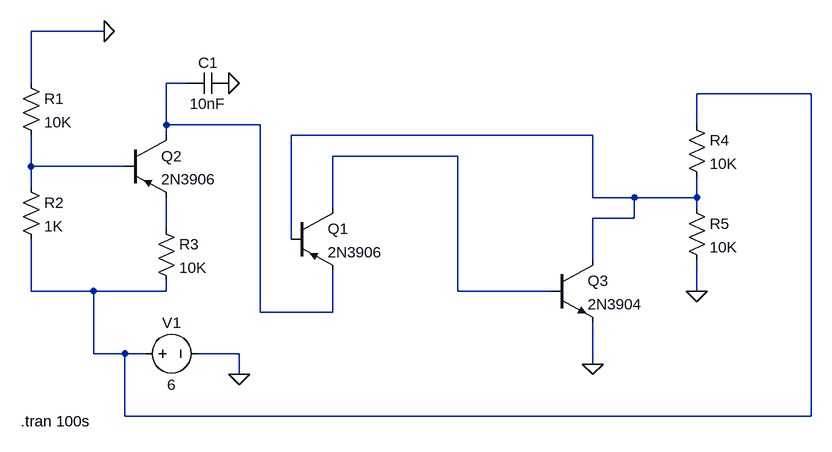
[diagram p0: schematic positive ramp.asc]
positive ramp.asc, the LTspice schematic file:
Version 4
SHEET 1 1044 680
WIRE -48 -112 -160 -112
WIRE -160 -32 -160 -112
WIRE 80 -32 48 -32
WIRE 1040 -16 864 -16
WIRE 48 32 48 -32
WIRE 192 32 48 32
WIRE 864 32 864 -16
WIRE 48 48 48 32
WIRE 704 48 240 48
WIRE 496 80 304 80
WIRE -160 96 -160 48
WIRE -16 96 -160 96
WIRE -160 128 -160 96
WIRE 704 144 704 48
WIRE 768 144 704 144
WIRE 864 144 864 112
WIRE 864 144 768 144
WIRE 304 160 304 80
WIRE 864 160 864 144
WIRE 768 176 768 144
WIRE 768 176 704 176
WIRE 48 192 48 144
WIRE 240 208 240 48
WIRE 704 240 704 176
WIRE -160 288 -160 208
WIRE -64 288 -160 288
WIRE 48 288 48 272
WIRE 48 288 -64 288
WIRE 496 288 496 80
WIRE 640 288 496 288
WIRE 864 288 864 240
WIRE 192 320 192 32
WIRE 304 320 304 256
WIRE 304 320 192 320
WIRE -64 384 -64 288
WIRE -16 384 -64 384
WIRE 16 384 -16 384
WIRE 160 384 96 384
WIRE 704 400 704 336
WIRE 160 416 160 384
WIRE -16 480 -16 384
WIRE 1040 480 1040 -16
WIRE 1040 480 -16 480
FLAG 160 416 0
FLAG -48 -112 0
FLAG 144 -32 0
FLAG 864 288 0
FLAG 704 400 0
SYMBOL pnp 240 160 R0
SYMATTR InstName Q1
SYMATTR Value 2N3906
SYMBOL pnp -16 48 R0
SYMATTR InstName Q2
SYMATTR Value 2N3906
SYMBOL npn 640 240 R0
SYMATTR InstName Q3
SYMATTR Value 2N3904
SYMBOL res -176 -48 R0
SYMATTR InstName R1
SYMATTR Value 10K
SYMBOL res -176 112 R0
SYMATTR InstName R2
SYMATTR Value 1K
SYMBOL res 32 176 R0
SYMATTR InstName R3
SYMATTR Value 10K
SYMBOL voltage 0 384 R270
WINDOW 0 32 56 VTop 2
WINDOW 3 -32 56 VBottom 2
WINDOW 123 0 0 Left 0
WINDOW 39 0 0 Left 0
SYMATTR InstName V1
SYMATTR Value 6
SYMBOL cap 144 -48 R90
WINDOW 0 0 32 VBottom 2
WINDOW 3 32 32 VTop 2
SYMATTR InstName C1
SYMATTR Value 10nF
SYMBOL res 848 16 R0
SYMATTR InstName R4
SYMATTR Value 10K
SYMBOL res 848 144 R0
SYMATTR InstName R5
SYMATTR Value 10K
TEXT -176 488 Left 2 !.tran 100s

The netlist it stands for:
* positive ramp.asc
Q1 N004 N003 N001 0 2N3906
Q2 N001 N005 N006 0 2N3906
Q3 N003 N004 0 0 2N3904
R1 0 N005 10K
R2 N005 N002 1K
R3 N006 N002 10K
V1 N002 0 6
C1 0 N001 10nF
R4 N002 N003 10K
R5 N003 0 10K
.model NPN NPN
.model PNP PNP
.lib standard.bjt
.tran 100s
.backanno
.end